# EAGLE schematic PAPx2-43 (EAGLE 7.2.0)
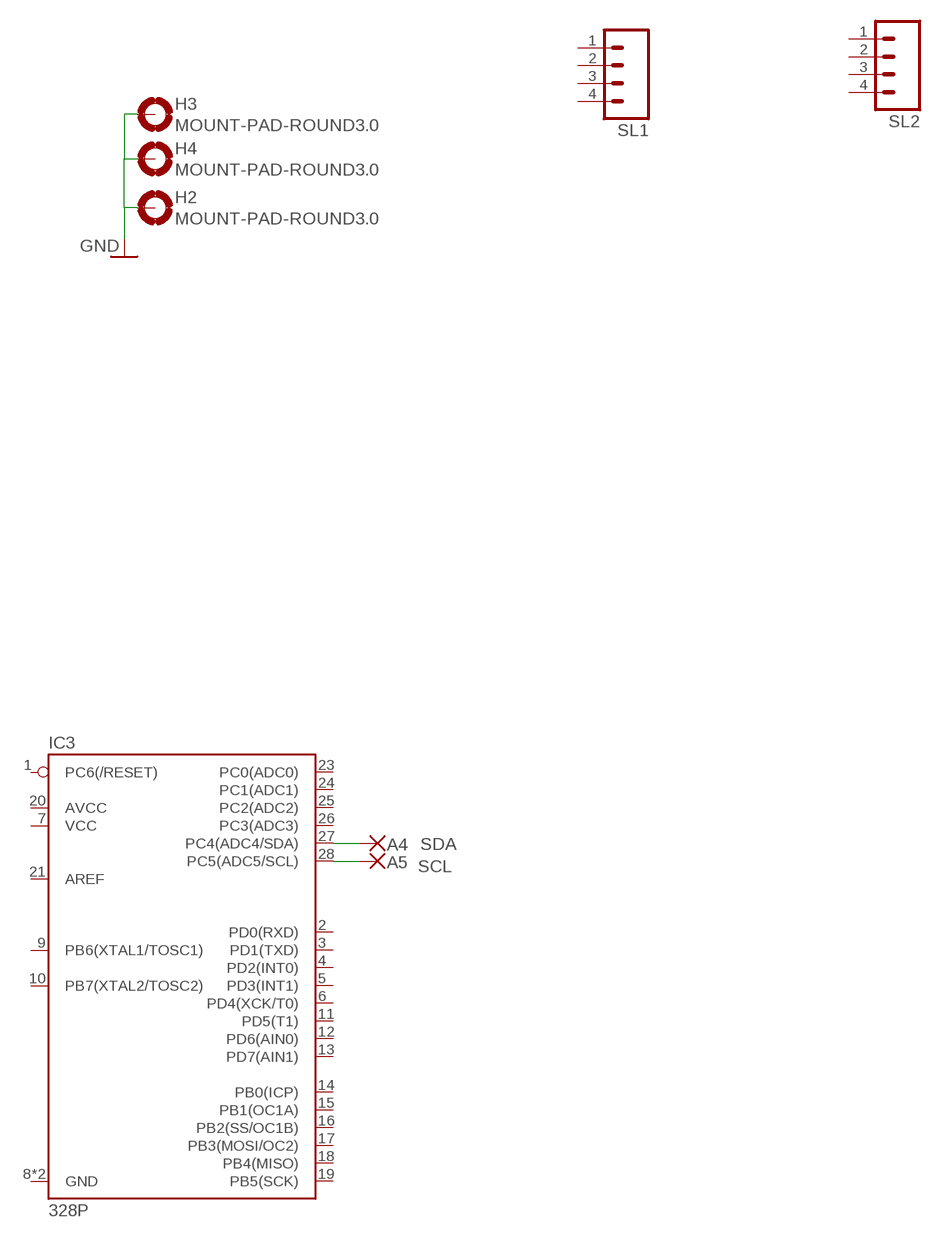
[diagram p0: schematic, sheet 1]

## Parts
A4  SDA  WIREPAD1,6/0,8  [1,6/0,8]
A5  SCL  WIREPAD1,6/0,8  [1,6/0,8]
H2  MOUNT-PAD-ROUND3.0  [3,0-PAD]
H3  MOUNT-PAD-ROUND3.0  [3,0-PAD]
H4  MOUNT-PAD-ROUND3.0  [3,0-PAD]
IC3  328P  ATMEGA328P  [DIP28]
SL1  M04  [04P]
SL2  M04  [04P]

## Nets
GND: H2.B3,0(MOUNT) H3.B3,0(MOUNT) H4.B3,0(MOUNT)
N$5: A4.1(P) IC3.27(PC4(ADC4/SDA))
N$6: A5.1(P) IC3.28(PC5(ADC5/SCL))
Unconnected: IC3.1(PC6(/RESET)) IC3.2(PD0(RXD)) IC3.3(PD1(TXD)) IC3.4(PD2(INT0)) IC3.5(PD3(INT1)) IC3.6(PD4(XCK/T0)) IC3.7(VCC) IC3.8(GND) IC3.9(PB6(XTAL1/TOSC1)) IC3.10(PB7(XTAL2/TOSC2)) IC3.11(PD5(T1)) IC3.12(PD6(AIN0)) IC3.13(PD7(AIN1)) IC3.14(PB0(ICP)) IC3.15(PB1(OC1A)) IC3.16(PB2(SS/OC1B)) IC3.17(PB3(MOSI/OC2)) IC3.18(PB4(MISO)) IC3.19(PB5(SCK)) IC3.20(AVCC) IC3.21(AREF) IC3.22(GND) IC3.23(PC0(ADC0)) IC3.24(PC1(ADC1)) IC3.25(PC2(ADC2)) IC3.26(PC3(ADC3)) SL1.1 SL1.2 SL1.3 SL1.4 SL2.1 SL2.2 SL2.3 SL2.4

## Library data of the parts
A4 A5 = wirepad:WIREPAD: Wire PAD connect wire on PCB
H2-H4 = holes:MOUNT-PAD-ROUND: MOUNTING PAD, round
IC3 = treser_lib:ATMEGA328P: Atmel ATMEGA328P 32kb flash, 1k EEPROM, 2k SRAM; PROD_ID: IC-09136
SL1 SL2 = con-amp-quick:M04: AMP QUICK CONNECTOR; OC_FARNELL: unknown; OC_NEWARK: unknown